# EAGLE design Crystal_Driver (EAGLE 9.6.2)
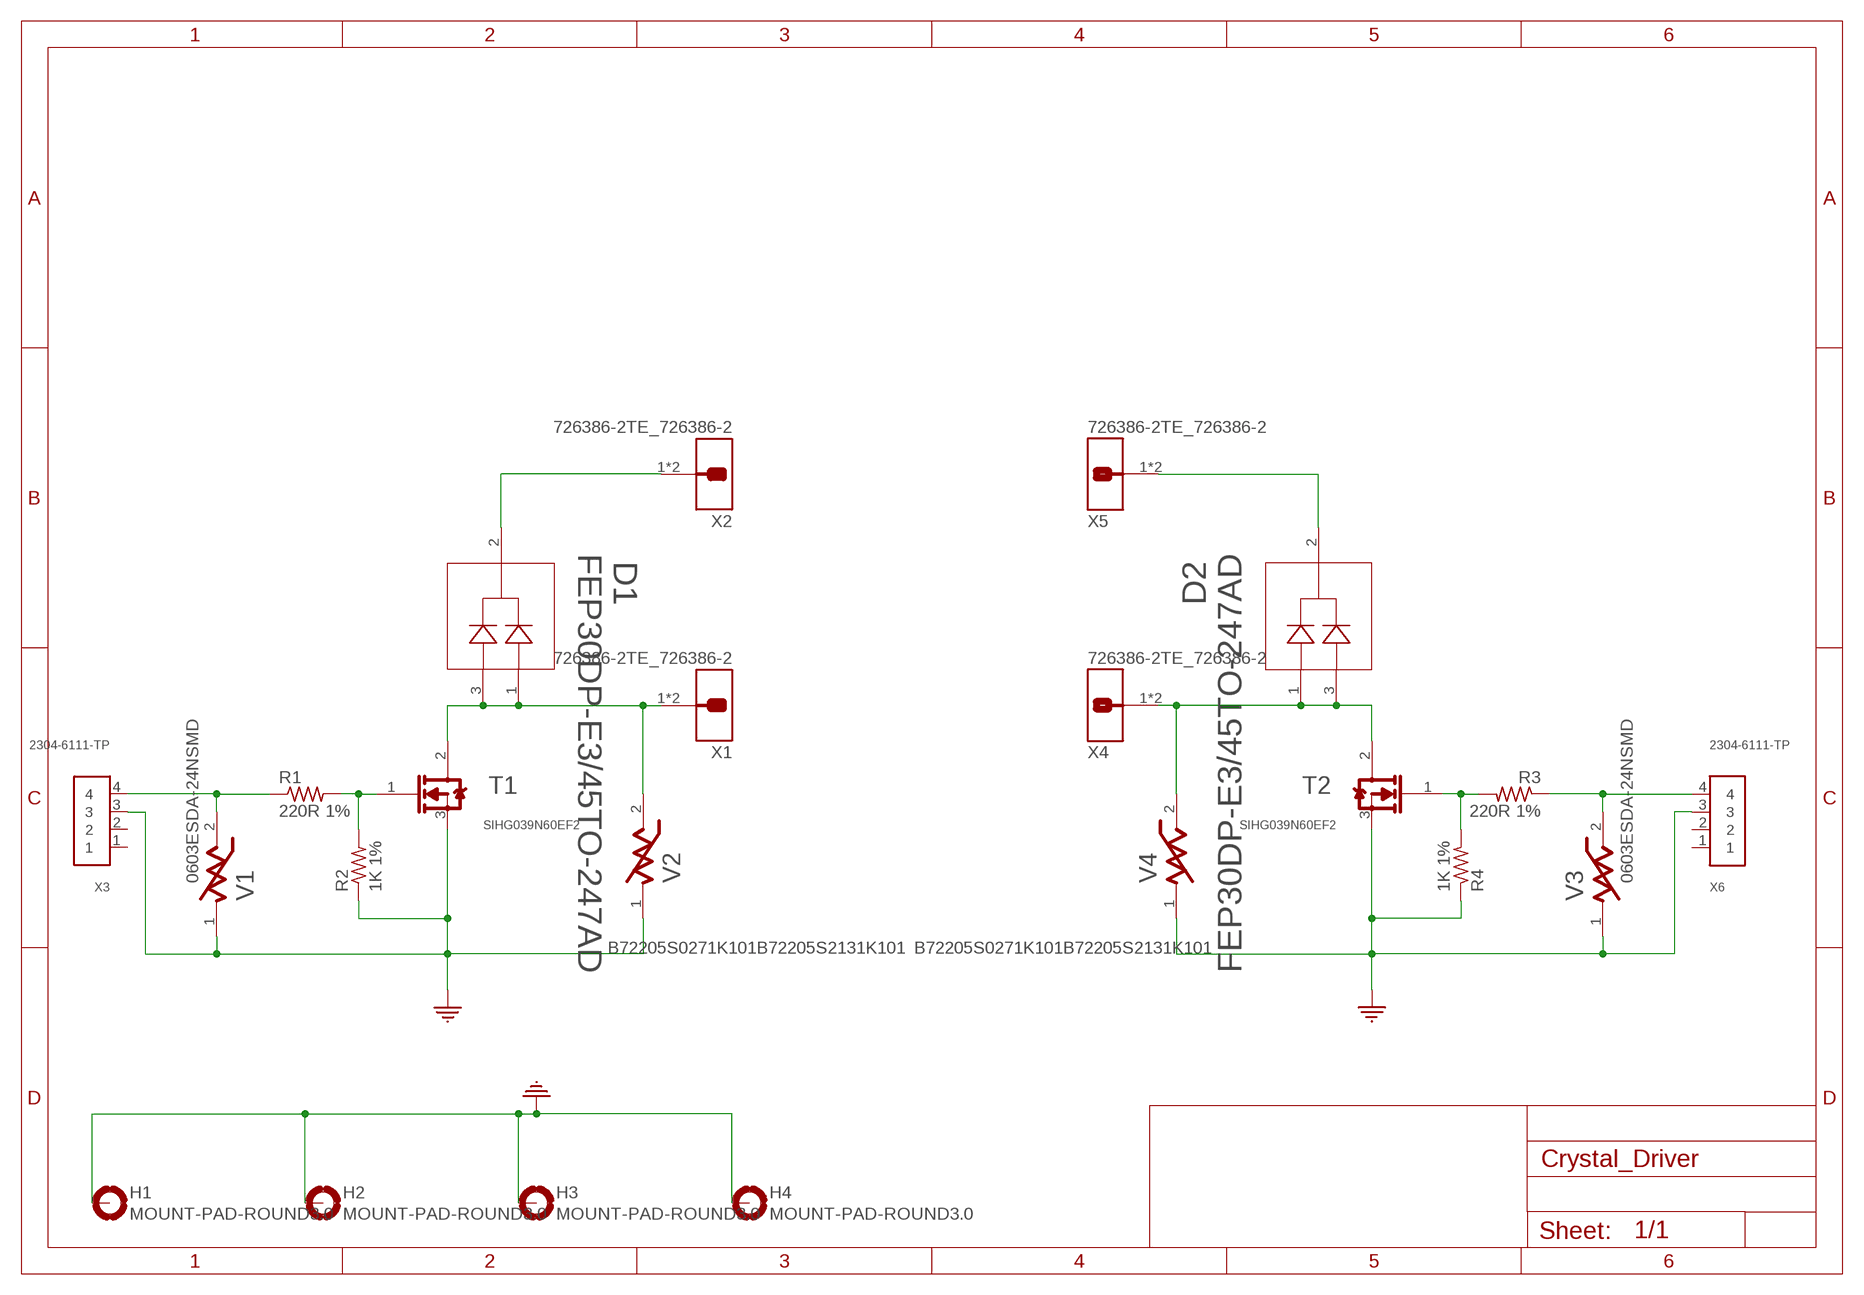
[diagram p0: schematic, sheet 1]

## Parts
D1  FEP30DP-E3/45TO-247AD  [TO-247AD]
D2  FEP30DP-E3/45TO-247AD  [TO-247AD]
H1  MOUNT-PAD-ROUND3.0  [3,0-PAD]
H2  MOUNT-PAD-ROUND3.0  [3,0-PAD]
H3  MOUNT-PAD-ROUND3.0  [3,0-PAD]
H4  MOUNT-PAD-ROUND3.0  [3,0-PAD]
R1  220R 1%  R_1206EIA1206  [EIA1206]
R2  1K 1%  R_0603  [EIA0603]
R3  220R 1%  R_1206EIA1206  [EIA1206]
R4  1K 1%  R_0603  [EIA0603]
T1  SIHG039N60EF2  [TO-247AC]
T2  SIHG039N60EF2  [TO-247AC]
V1  0603ESDA-24NSMD  [EIA0603]
V2  B72205S0271K101B72205S2131K101  [EPCOS_B72205S0271K101_0]
V3  0603ESDA-24NSMD  [EIA0603]
V4  B72205S0271K101B72205S2131K101  [EPCOS_B72205S0271K101_0]
X1  726386-2TE_726386-2  [TE_726386-2]
X2  726386-2TE_726386-2  [TE_726386-2]
X3  2304-6111-TP  [X04_100MIL]
X4  726386-2TE_726386-2  [TE_726386-2]
X5  726386-2TE_726386-2  [TE_726386-2]
X6  2304-6111-TP  [X04_100MIL]

## Nets
GND: H1.B3,0(MOUNT) H2.B3,0(MOUNT) H3.B3,0(MOUNT) H4.B3,0(MOUNT) R2.1 R4.1 T1.3(S) T2.3(S) V1.1 V2.1 V3.1 V4.1 X3.3 X6.3
N$2 [High_V]: R1.2 R2.2 T1.1(G)
N$3 [High_V]: D1.1 D1.3 T1.2(D) V2.2 X1.1 X1.1-2
N$4 [High_V]: D1.2 X2.1 X2.1-2
N$5: R1.1 V1.2 X3.4
N$7: R3.2 R4.2 T2.1(G)
N$8 [High_V]: D2.1 D2.3 T2.2(D) V4.2 X4.1 X4.1-2
N$9 [High_V]: D2.2 X5.1 X5.1-2
N$10: R3.1 V3.2 X6.4
Unconnected: X3.1 X3.2 X6.1 X6.2

## Library data of the parts
D1 D2 = Labops_Lib_AH:FEP30DP-E3/45; DESCRIPTION: Dual Diode, Fast Recovery, 15A,600V, Common Cathode, TO-247AD; MFN: FEP30JP-E3/45; PART_VALUE: Diode 2x15A
H1-H4 = holes:MOUNT-PAD-ROUND: MOUNTING PAD, round
R1 R3 = Labops_Lib_AH:R_1206; MFN: Open Source R1206
R2 R4 = Labops_Lib_AH:R_0603; MFN: Open Source 0603
T1 T2 = Labops_Lib_AH:SIHG039N60EF: N-Channel, 600V, 61A, TO247AC
V1 V3 = Labops_Lib_AH:0603ESDA-24N; DESCRIPTION: aristor 0603 SMD Bidirectional 50V 24V; MFN: 0603ESDA-24N; MFR: Bourns; SUPPLIER-1: LCSC
V2 V4 = Labops_Lib_AH:B72205S0271K101: VARISTOR 205V 800A DISC 5MM; LIB_STATUS: Verified; MFN: B72205S0271K1011; MFR: EPCOS; OUR_STOCK: 10; PART_VALUE: 430V, 400A; PRICE-1: 0.31; SUPPLIER-1: Digikey
X1 X2 X4 X5 = Labops_Lib_AH:726386-2: Terminals, Faston, GDS-Flachstecker 6.3x0.8mm, TE; CENTROID_NOT_SPECIFIED: No; CONN_GENDER: Male; CONN_ORIENTATION: Straight; CONTACT_MATERIAL: Tin; DATASHEET: http://www.te.com/commerce/DocumentDelivery/DDEController?Action=showdoc&DocId=Customer+Drawing%7F726386%7FG%7Fpdf%7FEnglish%7FENG_CD_726386_G.pdf%7F726386-2; DEVICE_CLASS_L1: Connectors; DEVICE_CLASS_L2: Terminal Blocks | Terminals; DEVICE_CLASS_L3: unset; DIGIKEY_DESCRIPTION: CONN QC TAB 0.250 SOLDER; DIGIKEY_PART_NUMBER: A114371-ND; HEIGHT: 10mm; LEAD_FREE: yes; MF: TE; MFG_PACKAGE_IDENT: 726386-2; MFG_PACKAGE_IDENT_DATE: 0; MFG_PACKAGE_IDENT_REV: 0; MOUSER_DESCRIPTION: Terminals GDS-FLACHSTECK 6.3; MOUSER_PART_NUMBER: 571-726386-2; MPN: 726386-2; PACKAGE: PTH_TERMINAL_8MM0_0MM8; PREFIX: J; ROHS: yes; TEMPERATURE_RANGE_HIGH: +110°C; TEMPERATURE_RANGE_LOW: -30°C; VERIFICATION_VERSION: 0.0.0.1
X3 X6 = Labops_Lib_AH:2304-6111-TP; DESCRIPTION: 4 Pin THT Connector 100 mil pitch; MFN: 2304-6111-TP; MFR: 3M; PART_VALUE: X04 Connector 100mil

## Net classes
1 High_V: clearance 1.27 mm to class 0

## Board
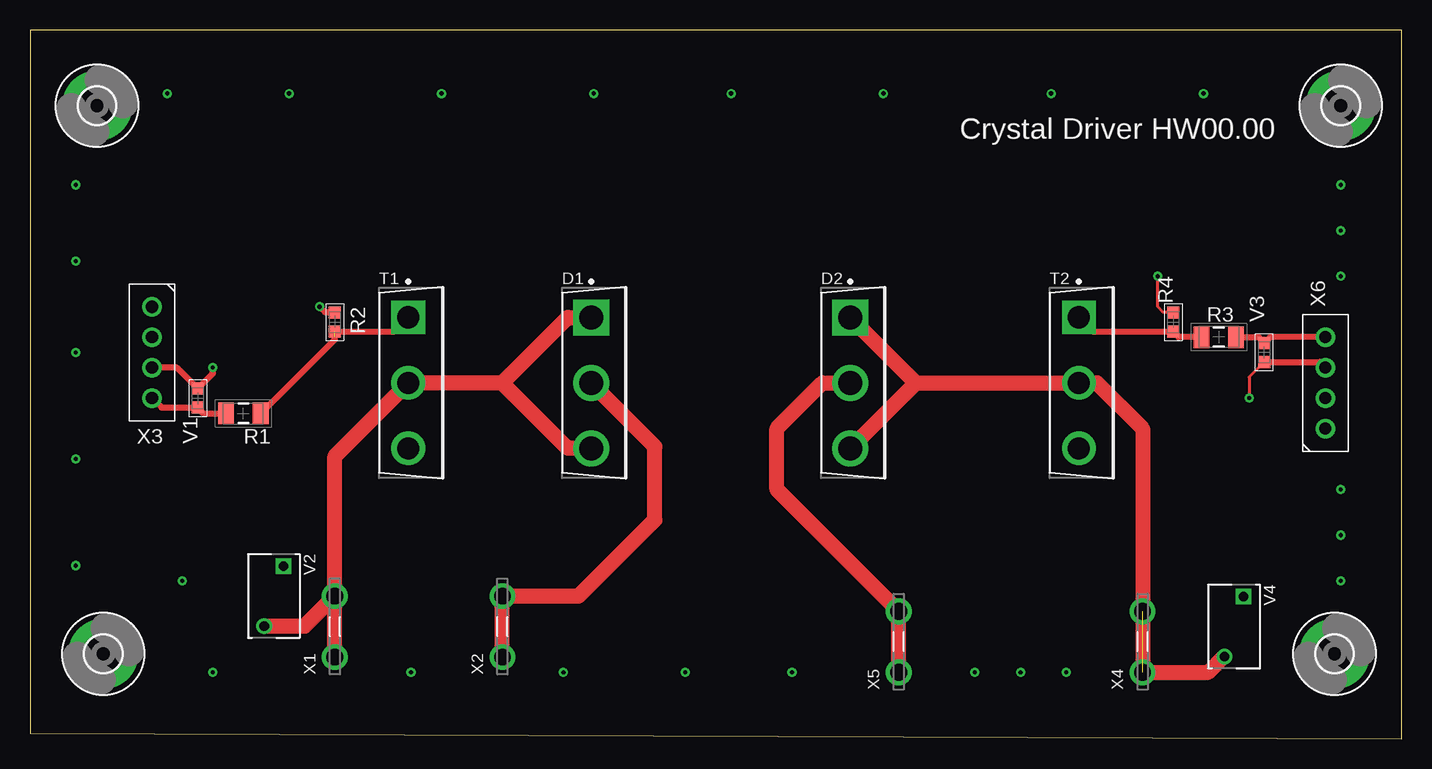
[diagram p1: board, top side]
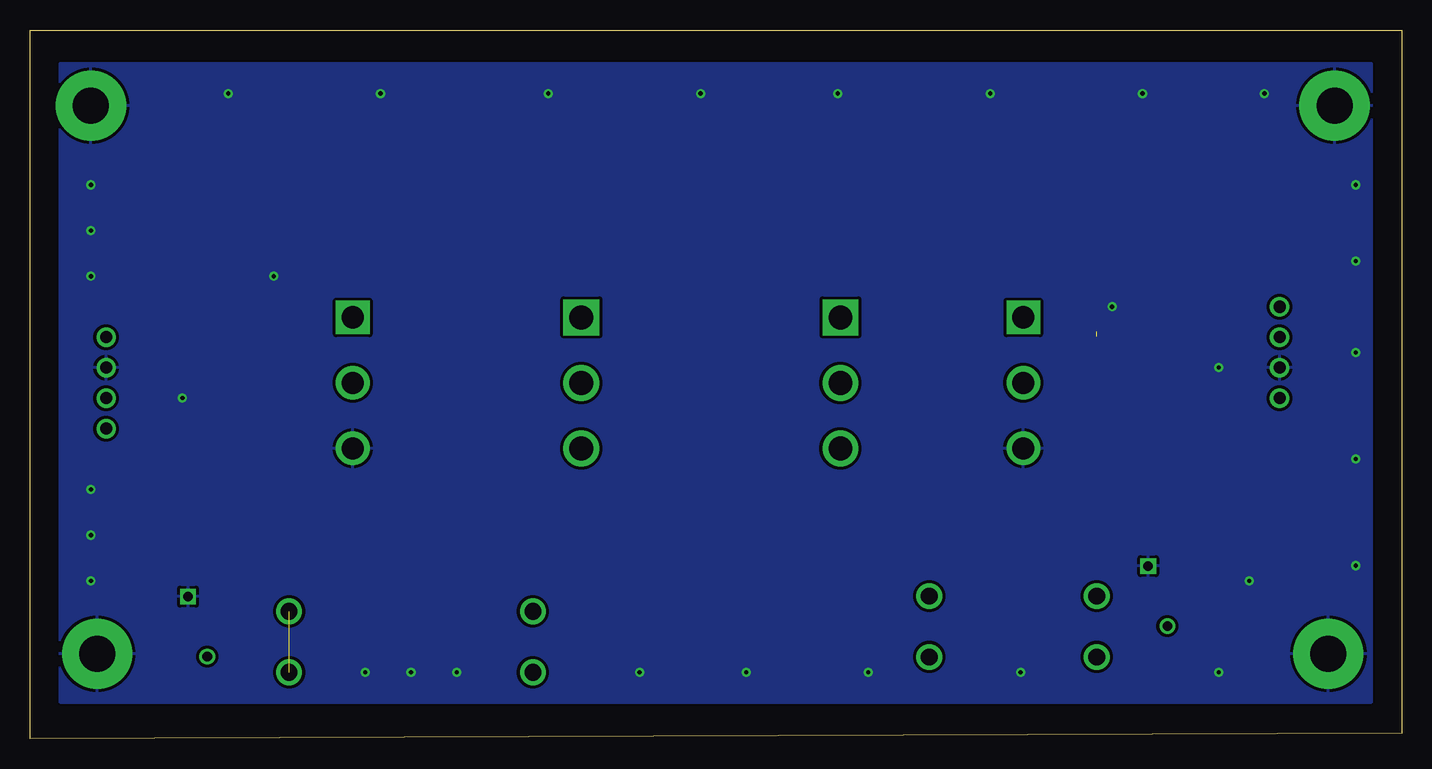
[diagram p2: board, bottom side, seen from below]

Size 114.3 x 59.11 mm. Coordinates in mm from the lower left corner, seen from the top.
Outline: 0,0.47 114.3,0 114.3,59.11 0,59.07 0,0.47
Copper layers (1*16): Top 0.035mm / dielectric 1.5mm / Bottom 0.035mm
Design rules "default *": minimum track width 6mil, minimum drill 0.35mm, track to track 10mil, track to pad 10mil, pad to pad 10mil, via to via 10mil, smd to smd 6mil, copper to edge 40mil, drill to drill 6mil, minimum pad ring 10mil, minimum via ring 8mil, stop-mask expansion 4mil, vias tented up to drill 0mil, thermal gap 10mil

### Footprints (pad centres in the part's own frame; a part is rotated, then mirrored left to right if it is on the bottom)
TO-247AD = drill 1.99 square: 1 -0.227,5.46 | drill 1.99: 2 -0.227,0; 3 -0.227,-5.46
3,0-PAD = drill 3 pad 5.842: B3,0 0,0
EIA1206 = smd 1.3 x 1.8: 1 -1.45,0; 2 1.45,0
EIA0603 = smd 1 x 1: 1 -0.8,0; 2 0.8,0
TO-247AC = drill 1.85 pad 2.8 square: 1 -0.227,5.46 | drill 1.85 pad 2.8: 2 -0.227,0; 3 -0.227,-5.46
EPCOS_B72205S0271K101_0 = drill 0.8 pad 1.3 square: 1 -2.5,0.8 | drill 0.8 pad 1.3: 2 2.5,-0.8
TE_726386-2 = drill 1.4 pad 2.15: 1 -2.54,0; 1-2 2.54,0
X04_100MIL = drill 1.016 pad 1.616: 1 0,0; 2 2.54,0; 3 5.08,0; 4 7.62,0

### Placement (x,y rotation side)
D1  46.99,29.68 0 top
D2  68.58,29.68 0 top
H1  6.1,7.07 0 top
H2  5.59,52.79 0 top
H3  109.22,52.79 0 top
H4  108.71,7.07 0 top
R1  17.78,27.14 0 top
R2  25.4,34.76 270 top
R3  99.06,33.49 180 top
R4  95.25,34.76 270 top
T1  31.75,29.68 0 top
T2  87.63,29.68 0 top
V1  13.97,28.41 270 top
V2  20.32,11.9 270 top
V3  102.87,32.22 90 top
V4  100.33,9.36 270 top
X1  25.4,9.36 90 top
X2  39.37,9.36 90 top
X3  10.16,36.03 270 top
X4  92.71,8.09 90 top
X5  72.39,8.09 90 top
X6  107.95,25.87 90 top

### Tracks (layer width: path | path; a pad name or v marks a point on that pad's centre or on a via)
GND  (via drill 0.35)
  Top 0.254: V3.1 101.6,30.15 v101.6,28.41 | R4.1 94.45,35.56 93.98,36.03 v93.98,38.57
  Top 0.508: V1.1 14.44,29.68 | V1.1 12.23,30.95 X3.3 | V3.1 107.48,31.42 X6.3 | V1.1 15.24,30.48 v15.24,30.95 | R2.1 24.6,35.56 v24.13,36.03
  other vias: 3.81,39.84 3.81,46.19 3.81,32.22 3.81,23.33 3.81,14.44 12.7,13.17 15.24,5.55 31.75,5.55 11.43,53.81 21.59,53.81 34.29,53.81 46.99,53.81 58.42,53.81 71.12,53.81 44.45,5.55 54.61,5.55 63.5,5.55 78.74,5.55 82.55,5.55 86.36,5.55 109.22,13.17 109.22,16.98 109.22,20.79 109.22,38.57 109.22,42.38 109.22,46.19 97.79,53.81 85.09,53.81
  pour Bottom: 2.54,56.35 2.54,3.01 111.76,3.01 111.76,56.35
N$2  (1 unrouted)
  Top 0.508: R1.2 25.4,33.31 25.4,33.54 | R2.2 30.34,33.96 T1.1
N$3
  Top 1.27: D1.3 44.83,24.22 39.37,29.68 | 39.37,29.68 T1.2 25.4,23.56 X1.1-2 | 39.37,29.68 44.83,35.14 D1.1 | X1.1 X1.1-2 | V2.2 22.9,9.4 X1.1-2
N$4
  Top 1.27: X2.1 X2.1-2 45.72,11.9 52.07,18.25 52.07,24.37 D1.2
N$5
  Top 0.508: X3.4 10.96,27.61 V1.2 14.44,27.14 R1.1
N$7
  Top 0.508: R3.2 95.72,33.49 R4.2 88.58,33.96 T2.1
N$8  (1 unrouted)
  Top 1.27: V4.2 98.22,5.55 X4.1 92.71,25.87 88.9,29.68 T2.2 73.81,29.68 | D2.1 73.81,29.68 | D2.3 73.81,29.68
N$9
  Top 1.27: X5.1 X5.1-2 62.23,20.79 62.23,25.87 66.04,29.68 D2.2
N$10
  Top 0.508: X6.4 103.34,33.49 V3.2 102.4,33.49 R3.1

### Text on the board
tNames: Crystal Driver HW00.00